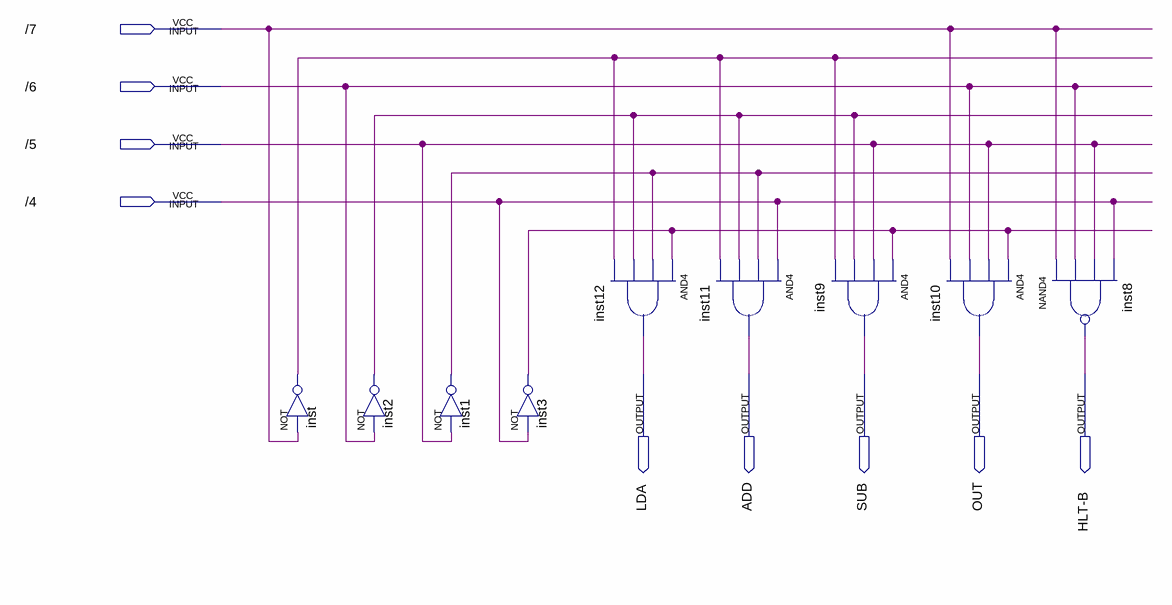
[diagram p0: schematic sheet]
// Quartus schematic Decodificador.bdf as structural Verilog: 9 symbols, 9 pins
module Decodificador (
  input  \/7 ,
  input  \/6 ,
  input  \/5 ,
  input  \/4 ,
  output LDA,
  output ADD,
  output SUB,
  output OUT,
  output \HLT-B 
);

  wire inst1_out, inst2_out, inst3_out, inst_out;

  not inst (inst_out, \/7 );
  not inst2 (inst2_out, \/6 );
  not inst1 (inst1_out, \/5 );
  not inst3 (inst3_out, \/4 );
  and inst12 (LDA, inst3_out, inst1_out, inst2_out, inst_out);
  and inst11 (ADD, \/4 , inst1_out, inst2_out, inst_out);
  and inst9 (SUB, inst3_out, \/5 , inst2_out, inst_out);
  and inst10 (OUT, inst3_out, \/5 , \/6 , \/7 );
  nand inst8 (\HLT-B , \/7 , \/6 , \/5 , \/4 );
endmodule
